# Altium schematic sheet 08-modem2.SchDoc: Modem
size Letter; DrawnBy: J. Brinton; Engineer: J. Brinton; Revision: 1; SheetNumber: 8; SheetTotal: 14
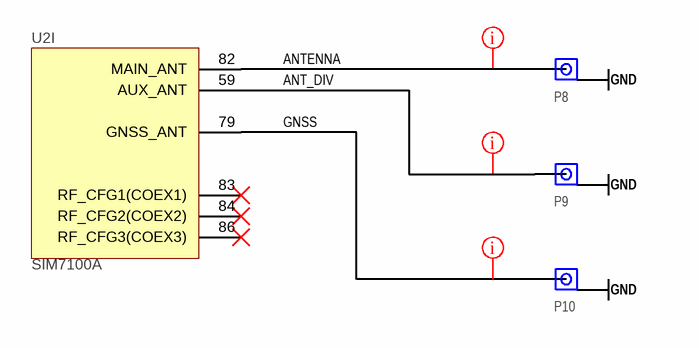
[diagram p0: 08-modem2.SchDoc]

## Parts
P8  U.FL-R-SMT(10)  [U.FL-R-SMT(10)]  (value not drawn)
P9  U.FL-R-SMT(10)  [U.FL-R-SMT(10)]  (value not drawn)
P10  U.FL-R-SMT(10)  [U.FL-R-SMT(10)]  (value not drawn)
U2  SIM7100A  [SIM7100A]  (part I of 10)

## Nets
GND: P8.2(GND) P9.2(GND) P10.2(GND)
ANT_DIV: P9.1(RF) U2.59(AUX_ANT)
ANTENNA: P8.1(RF) U2.82(MAIN_ANT)
GNSS: P10.1(RF) U2.79(GNSS_ANT)

Not connected (* = marked no-connect by the designer): U2 83(RF_CFG1(COEX1))* 84(RF_CFG2(COEX2))* 86(RF_CFG3(COEX3))*

## Layout directives
net class RF: ANT_DIV, ANTENNA, GNSS

## Notes on the sheet
- Designed By:
- Title
- Engineer
- Revision
- Drawn By
- Date
- Sheet
- of

## Library data of the parts
P8-P10 = U.FL-R-SMT(10): Ultra Miniature Coaxial Jack, 50 Ohms; Manufacturer: Hirose; Manufacturer P/N: U.FL-R-SMT(10)
U2 = Component_1: Cellular Module; Manufacturer: SIMCOM; Manufacturer P/N: SIM7100A